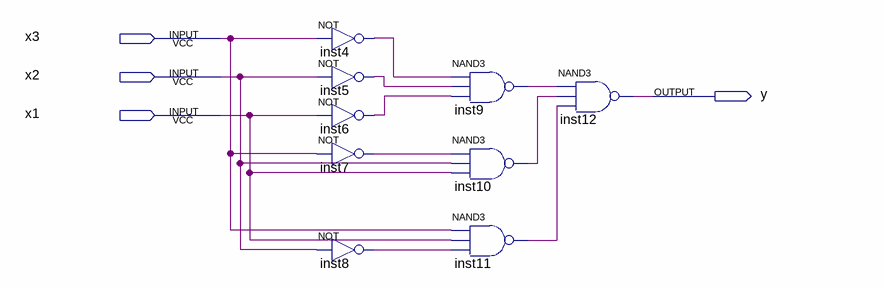
[diagram p0: schematic sheet]
// Quartus schematic LC1.bdf as structural Verilog: 9 symbols, 4 pins
module LC1 (
  input  x3,
  input  x2,
  input  x1,
  output y
);

  wire inst4_out, inst5_out, inst6_out, inst7_out, inst8_out, inst9_out, inst10_out, inst11_out;

  not inst4 (inst4_out, x3);
  not inst5 (inst5_out, x2);
  not inst6 (inst6_out, x1);
  not inst7 (inst7_out, x3);
  not inst8 (inst8_out, x2);
  nand inst9 (inst9_out, inst4_out, inst5_out, inst6_out);
  nand inst10 (inst10_out, inst7_out, x2, x1);
  nand inst11 (inst11_out, x3, x1, inst8_out);
  nand inst12 (y, inst9_out, inst10_out, inst11_out);
endmodule
